# Altium schematic sheet Battery and Charging.SchDoc: Battery and Charging
size 431 x 279 mm; DrawnBy: DD; DocumentNumber: GHL-1-21002; Revision: A; SheetNumber: 3; SheetTotal: 7; ProjectID: 263-03
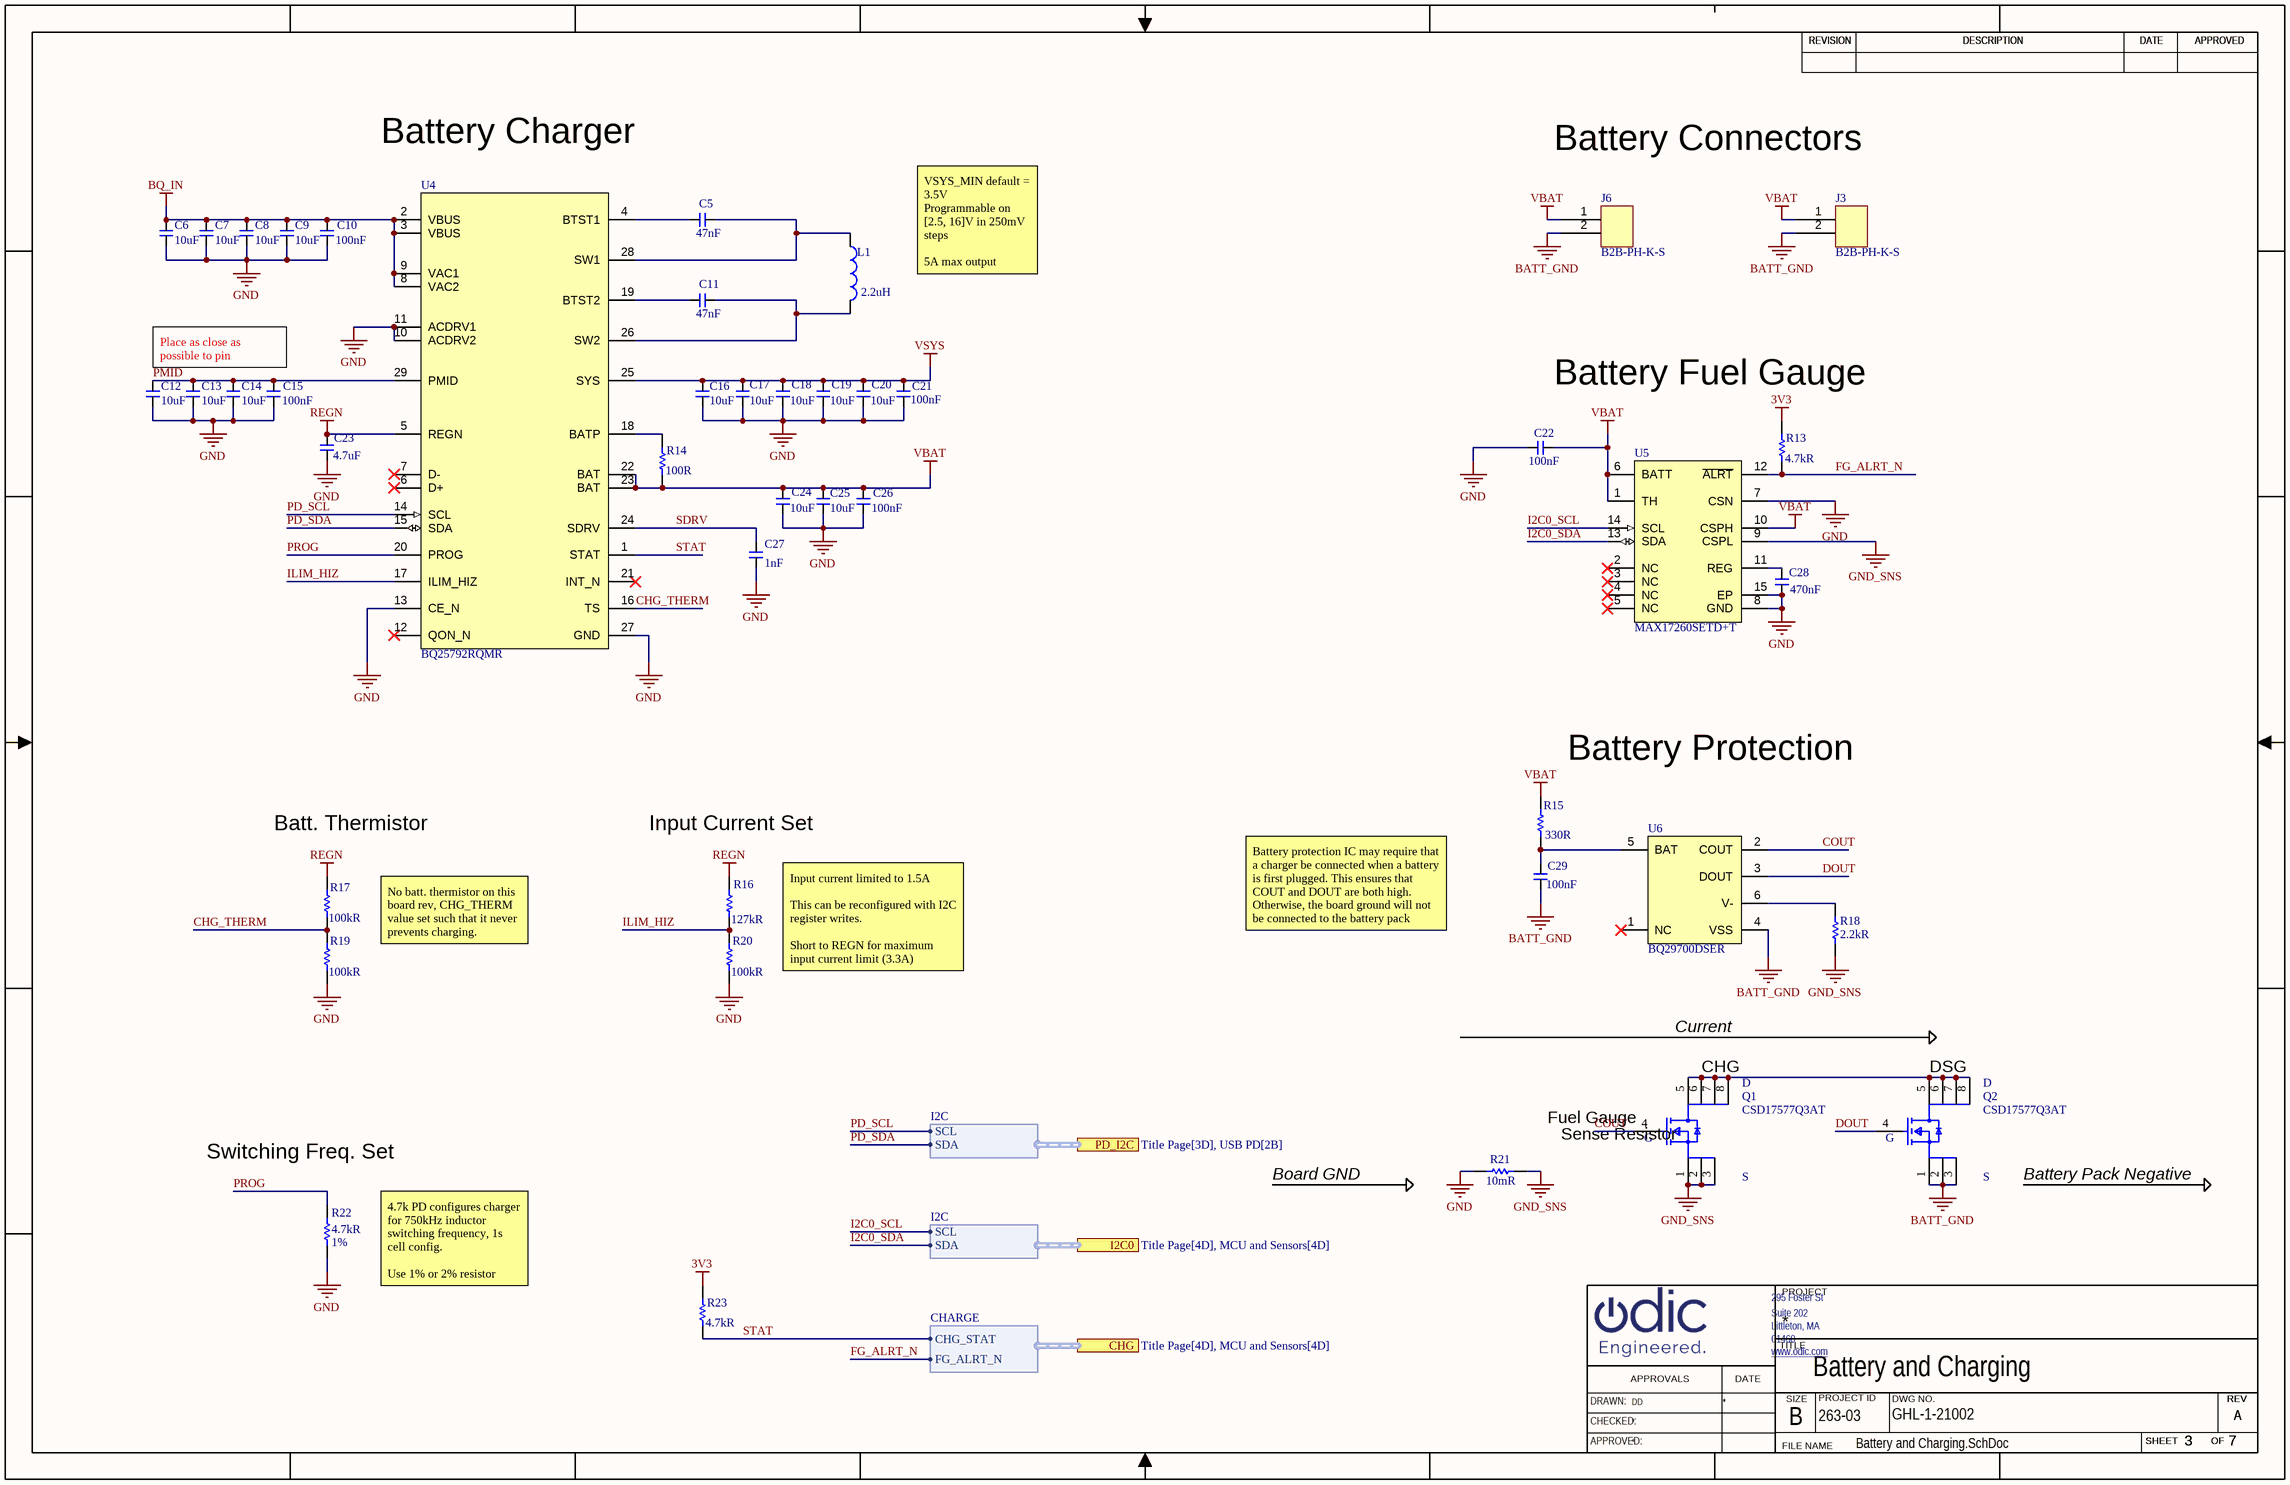
[diagram p0: Battery and Charging.SchDoc]

## Parts
C5  Capacitance: 47nF  [C0402]  (hidden comment: C0402_47n_50V_10pct)
C6  Capacitance: 10uF  [C0603]  (hidden comment: C0603_10u_25V_10pct)
C7  Capacitance: 10uF  [C0603]  (hidden comment: C0603_10u_25V_10pct)
C8  Capacitance: 10uF  [C0603]  (hidden comment: C0603_10u_25V_10pct)
C9  Capacitance: 10uF  [C0603]  (hidden comment: C0603_10u_25V_10pct)
C10  Capacitance: 100nF  [C0402]  (hidden comment: C0402_0u1_25V_10pct)
C11  Capacitance: 47nF  [C0402]  (hidden comment: C0402_47n_50V_10pct)
C12  Capacitance: 10uF  [C0603]  (hidden comment: C0603_10u_25V_10pct)
C13  Capacitance: 10uF  [C0603]  (hidden comment: C0603_10u_25V_10pct)
C14  Capacitance: 10uF  [C0603]  (hidden comment: C0603_10u_25V_10pct)
C15  Capacitance: 100nF  [C0402]  (hidden comment: C0402_0u1_25V_10pct)
C16  Capacitance: 10uF  [C0603]  (hidden comment: C0603_10u_25V_10pct)
C17  Capacitance: 10uF  [C0603]  (hidden comment: C0603_10u_25V_10pct)
C18  Capacitance: 10uF  [C0603]  (hidden comment: C0603_10u_25V_10pct)
C19  Capacitance: 10uF  [C0603]  (hidden comment: C0603_10u_25V_10pct)
C20  Capacitance: 10uF  [C0603]  (hidden comment: C0603_10u_25V_10pct)
C21  Capacitance: 100nF  [C0402]  (hidden comment: C0402_0u1_25V_10pct)
C22  Capacitance: 100nF  [C0402]  (hidden comment: C0402_100n_16V_10pct)
C23  Capacitance: 4.7uF  [C0402]  (hidden comment: C0402_4u7_10V_20pct)
C24  Capacitance: 10uF  [C0603]  (hidden comment: C0603_10u_25V_10pct)
C25  Capacitance: 10uF  [C0603]  (hidden comment: C0603_10u_25V_10pct)
C26  Capacitance: 100nF  [C0402]  (hidden comment: C0402_0u1_25V_10pct)
C27  Capacitance: 1nF  [C0402]  (hidden comment: C0402_1n_50V_10pct)
C28  Capacitance: 470nF  [C0402]  (hidden comment: C0402_470n_6V3_10pct)
C29  Capacitance: 100nF  [C0402]  (hidden comment: C0402_100n_16V_10pct)
J3  B2B-PH-K-S  [JST_B2B-PH-K-S]
J6  B2B-PH-K-S  [JST_B2B-PH-K-S]
L1  value 2.2uH  [ind2_5p4x5p2mm]  (hidden comment: 0530CDMCCDS-2R2MC)
Q1  CSD17577Q3AT  [dfn8_3p1x3p25_p65mm]
Q2  CSD17577Q3AT  [dfn8_3p1x3p25_p65mm]
R13  Resistance: 4.7kR  [R0402]  (hidden comment: R0402_4k7_1pct)
R14  value 100R  [R0402]  (hidden comment: R0402_100R_1pct)
R15  value 330R  [R0402]  (hidden comment: R0402_300R_1pct)
R16  value 127kR  [R0402]  (hidden comment: R0402_127k_1pct)
R17  Resistance: 100kR  [R0402]  (hidden comment: R0402_100k_1pct)
R18  Resistance: 2.2kR  [R0402]  (hidden comment: R0402_2k2_5pct)
R19  Resistance: 100kR  [R0402]  (hidden comment: R0402_100k_1pct)
R20  Resistance: 100kR  [R0402]  (hidden comment: R0402_100k_1pct)
R21  value 10mR  [R0603]  (hidden comment: R0603_0R01_1pct)
R22  Resistance Tolerance: 1%  Resistance: 4.7kR  [R0402]  (hidden comment: R0402_4k7_1pct)
R23  Resistance: 4.7kR  [R0402]  (hidden comment: R0402_4k7_1pct)
U4  BQ25792RQMR  [qfn29_4x4_p4mm-RQM0029A]
U5  MAX17260SETD+T  [dfn14_3x3_p4mm]
U6  BQ29700DSER  [dfn6_1p5x1p5_p5mm]

## Ports
CHG (harness CHARGE, see Title Page[4D], MCU and Sensors[4D]), I2C0 (harness I2C, see Title Page[4D], MCU and Sensors[4D]), PD_I2C (harness I2C, see Title Page[3D], USB PD[2B])

## Harnesses
CHARGE: CHG_STAT, FG_ALRT_N
I2C: SCL, SDA

## Nets
3V3: R13.2 R23.2
BATT_GND: C29.1 J3.2 J6.2 Q2.1(S) Q2.2(S) Q2.3(S) U6.4(VSS)
BQ_IN: C6.2 C7.2 C8.2 C9.2 C10.2 U4.2(VBUS) U4.3(VBUS) U4.8(VAC2) U4.9(VAC1)
GND: C6.1 C7.1 C8.1 C9.1 C10.1 C12.1 C13.1 C14.1 C15.1 C16.1 C17.1 C18.1 C19.1 C20.1 C21.1 C22.2 C23.1 C24.1 C25.1 C26.1 C27.1 C28.1 R19.1 R20.1 R21.1 R22.1 U4.10(ACDRV2) U4.11(ACDRV1) U4.13(CE_N) U4.27(GND) U5.7(CSN) U5.8(GND) U5.15(EP)
GND_SNS: Q1.1(S) Q1.2(S) Q1.3(S) R18.2 R21.2 U5.9(CSPL)
REGN: C23.2 R16.2 R17.2 U4.5(REGN)
VBAT: C22.1 C24.2 C25.2 C26.2 J3.1 J6.1 R14.1 R15.2 U4.22(BAT) U4.23(BAT) U5.1(TH) U5.6(BATT) U5.10(CSPH)
VSYS: C16.2 C17.2 C18.2 C19.2 C20.2 C21.2 U4.25(SYS)
CHG_THERM: R17.1 R19.2 U4.16(TS)
COUT: Q1.4(G) U6.2(COUT)
DOUT: Q2.4(G) U6.3(DOUT)
FG_ALRT_N: R13.1 U5.12(~{ALRT}) ; port CHG.FG_ALRT_N
I2C0_SCL: U5.14(SCL) ; port I2C0.SCL
I2C0_SDA: U5.13(SDA) ; port I2C0.SDA
ILIM_HIZ: R16.1 R20.2 U4.17(ILIM_HIZ)
PD_SCL: U4.14(SCL) ; port PD_I2C.SCL
PD_SDA: U4.15(SDA) ; port PD_I2C.SDA
PMID: C12.2 C13.2 C14.2 C15.2 U4.29(PMID)
PROG: R22.2 U4.20(PROG)
SDRV: C27.2 U4.24(SDRV)
STAT: R23.1 U4.1(STAT) ; port CHG.CHG_STAT
NetC5_1: C5.1 L1.1 U4.28(SW1)
NetC5_2: C5.2 U4.4(BTST1)
NetC11_1: C11.1 L1.2 U4.26(SW2)
NetC11_2: C11.2 U4.19(BTST2)
NetC28_2: C28.2 U5.11(REG)
NetC29_2: C29.2 R15.1 U6.5(BAT)
NetQ1_5: Q1.5(D) Q1.6(D) Q1.7(D) Q1.8(D) Q2.5(D) Q2.6(D) Q2.7(D) Q2.8(D)
NetR14_2: R14.2 U4.18(BATP)
NetR18_1: R18.1 U6.6(V-)

Not connected (* = marked no-connect by the designer): U4 6(D+)* 7(D-)* 12(QON_N)* 21(INT_N)*; U5 2(NC)* 3(NC)* 4(NC)* 5(NC)*; U6 1(NC)*

## Notes on the sheet
- Battery Charger
- Battery Connectors
- VSYS_MIN default = 3.5V
  Programmable on [2.5, 16]V in 250mV steps
  5A max output
- Place as close as possible to pin
- Battery Fuel Gauge
- (near R15) Battery Protection
- Batt. Thermistor
- Input Current Set
- No batt. thermistor on this board rev, CHG_THERM value set such that it never prevents charging.
- Input current limited to 1.5A
  This can be reconfigured with I2C register writes.
  Short to REGN for maximum input current limit (3.3A)
- Battery protection IC may require that a charger be connected when a battery is first plugged. This ensures that COUT and DOUT are both high. Otherwise, the board ground will not be connected to the battery pack negative
- Current
- (near Q1) CHG
- (near Q2) DSG
- Switching Freq. Set
- (near R21) Fuel Gauge
- (near R21) Sense Resistor
- Board GND
- Battery Pack Negative
- 4.7k PD configures charger for 750kHz inductor switching frequency, 1s cell config.
  Use 1% or 2% resistor
- REVISION
- DESCRIPTION
- DATE
- APPROVED
- 295 Foster St
- PROJECT
- www.odic.com <http://www.odic.com>
- Littleton, MA
- 01460
- Suite 202
- TITLE
- DRAWN:
- CHECKED:
- APPROVALS
- SIZE
- B
- PROJECT ID
- DWG NO.
- SHEET
- OF
- REV
- APPROVED:
- FILE NAME

## Library data of the parts
C5 C11 = CMP-00644-3: CGA2B3X7R1H473K050BB; Voltage Rating (DC): 50V; Tolerance: 10%; Dielectric: X7R; Install: POP; Weight: 2.3E-05oz; Case Code (Metric): 1005; Min Operating Temperature: -55°C; Width: 0.02inch; RoHS Compliant: Yes; Thickness: 0.022inch; Ratings: AEC-Q200; Case/Package: 0402; Reach SVHC Compliant: No; Lead Free: Lead Free; Construction: Flat; Mount: Surface Mount; Depth: 0.5mm; Max Operating Temperature: 125°C; Voltage Rating: 50V; Packaging: Tape and Reel; Package Quantity: 1; Series: CGA; Termination: SMD/SMT; Height: 0.5mm; Length: 1mm; Case Code (Imperial): 0402
C6-C9 C12-C14 C16-C20 C24 C25 = CMP-00643-2: GRM188R61E106KA73J; Tolerance: 10%; Voltage Rating: 25V; Install: POP; Case/Package: 0603; RoHS Compliant: Yes; Mount: Surface Mount; Max Operating Temperature: 85°C; Min Operating Temperature: -55°C; Series: GRM
C10 C15 C21 C26 = CMP-00369-1: Cap Ceramic 0.1uF 25V X5R 10% Pad SMD 0402 Multi Layer Ceramic Capacitor (MLCC); Install: POP; Packaging: Tape and Reel; Construction: Flat; Max Operating Temperature: 85°C; Case Code (Metric): 1005; Voltage Rating (DC): 25V; Min Operating Temperature: -55°C; Height: 0.5mm; Series: CL; Case/Package: 0402; Voltage: 25V; Package Quantity: 1; Radiation Hardening: No; Depth: 0.5mm; Thickness: 0.022inch; Lead Free: Lead Free; Tolerance: 10%; Length: 1mm; Mount: Surface Mount; Width: 0.02inch; Dielectric: X5R; RoHS Compliant: Yes; Voltage Rating: 25V; Case Code (Imperial): 0402
C22 C29 = CMP-00301-3: 0.1 µF ±10% 16V Ceramic Capacitor X7R 0402 (1005 Metric); Install: POP; Voltage: 16V; Voltage Rating (DC): 16V; Case/Package: 0402; RoHS Compliant: Yes; Dielectric Material: Ceramic; Package Quantity: 1; Dielectric: X7R; Termination: SMD/SMT; Depth: 0.5mm; Radiation Hardening: No; Construction: Flat; Tolerance: 10%; Case Code (Imperial): 0402; Voltage Rating: 16V; Max Operating Temperature: 125°C; Length: 1mm; Lead Free: Lead Free; REACH SVHC: No SVHC; Packaging: Tape and Reel; Mount: Surface Mount,PCB; Series: -; Case Code (Metric): 1005; Min Operating Temperature: -55°C; Width: 0.02inch; Thickness: 0.022inch; Height: 0.56mm; Contact Plating: Tin,Matte
C23 = CMP-00316-1: Cap Ceramic 4.7uF 10V X5R 20% SMD 0402 85°C Paper T/R; Install: POP; Width: 0.02inch; Package Quantity: 10000; Min Operating Temperature: -55°C; Mount: Surface Mount; Case Code (Imperial): 0402; Case/Package: 0402; Series: CL; Packaging: Cut Tape; Length: 0.039inch; Dielectric: X5R; Voltage Rating: 10V; Thickness: 0.022inch; Tolerance: 20%; Max Operating Temperature: 85°C; RoHS Compliant: Yes; Case Code (Metric): 1005; Lead Free: Lead Free
C27 = CMP-00366-1: 0402 1 nF 50V ±10 % Tolerance X7R Surface Mount Multilayer Ceramic Capacitor; Dissipation Factor: 2.5%; Install: POP; Tolerance: 10%; Insulation Resistance: 100GR; RoHS Compliant: Yes; Termination: SMD/SMT; Radiation Hardening: No; Length: 1mm; Contact Plating: Tin,Matte; Voltage Rating (DC): 50V; Thickness: 0.022inch; Case/Package: 0402; Height: 0.56mm; Mount: Surface Mount; Series: -; Construction: Flat; Lead Free: Lead Free; Case Code (Metric): 1005; Reach SVHC Compliant: Yes; Max Operating Temperature: 125°C; Width: 0.02inch; Depth: 0.5mm; Packaging: Tape and Reel; Number of Pins: 2; Voltage: 50V; Package Quantity: 1; Min Operating Temperature: -55°C; Dielectric: X7R; Voltage Rating: 50V; Case Code (Imperial): 0402
C28 = CMP-00343-1: Ceramic capacitor SMD-0402 470nF /6, 3V X5R# K +-10%, Samsung, RoHS; Dielectric: X5R; Voltage Rating: 6.3V; Install: POP; Tolerance: 10%; Height: 0.5mm; Case/Package: 0402; Contact Plating: Tin; Series: CL; Voltage Rating (DC): 6.3V; Lead Free: Lead Free; Mount: Surface Mount; Width: 0.02inch; Length: 1mm; Voltage: 6.3V; Thickness: 0.022inch; Package Quantity: 1; Case Code (Metric): 1005; Packaging: Tape and Reel; Radiation Hardening: No; Min Operating Temperature: -55°C; Depth: 0.5mm; Case Code (Imperial): 0402; RoHS Compliant: Yes; Construction: Flat; Max Operating Temperature: 85°C
J3 J6 = CMP-00685-3: Connector Header, PH Series, 2 Position, 2.00mm, Through Hole, Press-Fit, Solder, Natural; Working Voltage: 100V; Current Rating: 2A; Contact Resistance: 20mR; Mated Stacking Heights: 8mm; Contact Post Length: 0.134inch; Insulation Resistance: 1MR; Gender: Male; Number of Contacts: 2; Pitch: 2mm; Series: PH; Insulation Height: 0.236inch; Contact Plating: Tin,Copper; Contact Mating Length: 0.13inch; Depth: 4.5mm; Contact Finish - Mating: TIN; Max Voltage Rating (DC): 100V; Lead Free: Lead Free; Max Current Rating: 2A; Flammability Rating: UL94 V-0; Contact Material: Brass; Housing Color: White; Mounting Technology: Through Hole; Max Voltage Rating (AC): 100V; Number of Rows: 1; Contact Shape: Square; Voltage Rating: 100V; Length: 5.9mm; Housing Material: Polyamide; Pins: 2; Termination: Press-Fit; Height: 9.4mm; Lead Pitch: 2mm; Connector Type: Header; Width: 4.5mm; Orientation: Straight; Fastening Type: Detent; Min Operating Temperature: -25°C; Insulation Material: Nylon; Max Operating Temperature: 85°C; Color: Natural; Reach SVHC Compliant: Yes; Number of Poles: 2; Packaging: Bulk; Contact Type: Male Pin; Number of Positions: 2; Insulation Color: Natural; Voltage Rating (AC): 100V
L1 = CMP-00675-2: FIXED IND 2.2UH 5.8A 29 MOHM; Shielding: Shielded; Install: POP; Saturation Current: 9A; Tolerance: 20%; Core Material: Metal; DC Resistance (DCR): 29mR; Test Frequency: 100kHz; Length: 0.205inch; RoHS Compliant: Yes; Min Operating Temperature: -55°C; Case/Package: Nonstandard; Packaging: Tape and Reel; Series: 0530CDMC/DS; Max Operating Temperature: 125°C; Current Rating: 5.8A; Width: 0.205inch; Height - Seated (Max): 0.118inch; Mounting Technology: Surface Mount
Q1 Q2 = CMP-00688-3: 30-V, N channel NexFET™ power MOSFET, single SON 3 mm x 3 mm, 6.4 mOhm 8-VSONP -55 to 150; Drain to Source Resistance: 5.3mR; Power Dissipation: 2.8W; Threshold Voltage: 1.4V; Drain to Source Breakdown Voltage: 30V; Max Power Dissipation: 53W; Turn-Off Delay Time: 20ns; Number of Channels: 1; Gate to Source Voltage (Vgs): 20V; Rds On Max: 4.8mR; Fall Time: 4ns; Input Capacitance: 2.31nF; Polarity: N-CHANNEL; Continuous Drain Current (ID): 19A; Rise Time: 31ns; Install: POP; Case/Package: VSON; Pins: 8; Max Operating Temperature: 150°C; Series: NexFET™; Lead Free: Lead Free; Min Operating Temperature: -55°C; Element Configuration: Single; Reach SVHC Compliant: No; RoHS Compliant: Yes; Packaging: Tape and Reel; Number of Elements: 1; Mounting Technology: Surface Mount; Turn-On Delay Time: 4ns; Contact Plating: Tin; Drain to Source Voltage (Vdss): 30V; Package Quantity: 250
R13 R22 R23 = CMP-00336-2: RES 4.7K OHM 1% 1/16W 0402; Install: POP; Temperature Coefficient: 100ppm/°C; Voltage Rating: 50V; Max Power Dissipation: 63mW; Power Rating: 62.5mW; Features: Moisture Resistant; Length: 1mm; REACH SVHC: No SVHC; RoHS Compliant: Yes; Military Standard: Not; Size Code: 0402; Series: RC; Width: 0.5mm; Lead Free: Lead Free; Max Operating Temperature: 155°C; Height: 0.32mm; Voltage Rating (DC): 50V; Construction: Rectangular; Packaging: Tape and Reel; Tolerance: 1%; Case Code (Metric): 1005; Case Code (Imperial): 0402; Number of Pins: 2; Resistor Type: Thick Film; Number of Terminations: 2; Termination: SMD/SMT; Min Operating Temperature: -55°C; Case/Package: 0402; Height - Seated (Max): 0.016inch; Depth: 0.5mm
  R13 R23: Resistance Tolerance: 1%
R14 = CMP-009-00016-1: Res General Purpose Thick Film 0402 100 Ohm 1% 1/16W ±200ppm/°C Molded SMD Paper T/R; Voltage Rating (DC): 50V; Power Rating: 62.5mW; Install: POP; Max Power Dissipation: 63mW; Temperature Coefficient: 100ppm/°C; Reach SVHC Compliant: No; Construction: Rectangular; Case/Package: 0402; Military Standard: Not; Lead Free: Lead Free; Number of Terminations: 2; Case Code (Metric): 1005; Pins: 2; Width: 0.5mm; Features: Moisture Resistant; Tolerance: 1%; Packaging: Tape and Reel; Depth: 0.5mm; Technology: THICK FILM; Series: RC; Min Operating Temperature: -55°C; Height: 0.32mm; RoHS Compliant: Yes; Max Operating Temperature: 155°C; Voltage Rating: 50V; Case Code (Imperial): 0402; Resistance Tolerance: 1%; Termination: SMD/SMT; Resistor Type: Thick Film; Length: 1mm
R15 = CMP-00687-2: SMD Chip Resistor, 330 Ohm, ± 1%, 63 mW, 0402 [1005 Metric], Thick Film, General Purpose; Temperature Coefficient: 100ppm/°C; Voltage Rating: 50V; Max Power Dissipation: 63mW; Power Rating: 62.5mW; Install: POP; Resistance Tolerance: 1%; Packaging: Tape and Reel; Technology: THICK FILM; RoHS Compliant: Yes; Construction: Rectangular; Military Standard: Not; Min Operating Temperature: -55°C; Case Code (Imperial): 0402; Height: 0.016inch; Series: RC; Package Quantity: 1; Depth: 0.5mm; Resistor Type: Thick Film; Reach SVHC Compliant: No; Case/Package: 0402; Tolerance: 1%; Termination: SMD/SMT; Length: 0.039inch; Max Operating Temperature: 155°C; Features: Moisture Resistant; Lead Free: Lead Free; Case Code (Metric): 1005; Number of Terminations: 2; Width: 0.02inch
R16 = CMP-00681-2: SMD Chip Resistor, 127 kOhm, ± 1%, 63 mW, 0402 [1005 Metric], Thick Film, General Purpose; Power Rating: 62.5mW; Voltage Rating: 50V; Max Power Dissipation: 63mW; Temperature Coefficient: 100ppm/°C; Install: POP; Min Operating Temperature: -55°C; Tolerance: 1%; Number of Terminations: 2; Contact Plating: Tin,Matte; Length: 0.039inch; RoHS Compliant: Yes; Height: 0.016inch; Voltage Rating (DC): 50V; Series: RC; Termination: SMD/SMT; Features: Moisture Resistant; Max Operating Temperature: 155°C; Lead Free: Lead Free; Case/Package: 0402; Package Quantity: 1; Case Code (Metric): 1005; Packaging: Tape and Reel; Case Code (Imperial): 0402; Width: 0.02inch
R17 R19 R20 = CMP-00351-1: Res General Purpose Thick Film 0402 100K Ohm 1% 1/16W ±100ppm/°C Molded SMD Paper T/R; Working Voltage: 50V; Install: POP; Power Rating: 63mW; Series: RC; Military Standard: Not; Case Code (Metric): 1005; Features: Moisture Resistant; Termination: SMD/SMT; Number of Terminations: 2; Temperature Coefficient: 100ppm/°C; Height: 0.016inch; Tolerance: 1%; Case/Package: 0402; Depth: 0.5mm; RoHS Compliant: Yes; Resistance Tolerance: 1%; Lead Free: Lead Free; Max Operating Temperature: 155°C; Min Operating Temperature: -55°C; Width: 0.02inch; Packaging: Tape and Reel; Technology: THICK FILM; Case Code (Imperial): 0402; Package Quantity: 1; REACH SVHC: No SVHC; Resistor Type: Thick Film; Max Power Dissipation: 63mW; Voltage Rating: 50V; Length: 0.039inch; Construction: Rectangular
R18 = CMP-00405-3: Res Thick Film 0402 2.2K Ohm 5% 1/10W +/-200ppm/ßC Molded SMD Punched Carrier T/R; Power Rating: 100mW; Voltage Rating (DC): 50V; Temperature Coefficient: 200ppm/°C; Install: POP; Weight: 2.8E-05oz; Height: 0.35mm; Min Operating Temperature: -55°C; Package Quantity: 10000; Size Code: 0402; Packaging: Tape and Reel; Military Standard: Not; Mount: Surface Mount; Max Power Dissipation: 100mW; Tolerance: 5%; Voltage Rating: 50V; RoHS Compliant: Yes; Resistance Tolerance: 5%; Resistor Type: Thick Film; Series: ERJ; Termination: SMD/SMT; Case/Package: 0402; Ratings: AEC-Q200; Case Code (Imperial): 0402; Max Operating Temperature: 155°C; Length: 1mm; Lead Free: Lead Free; Technology: THICK FILM; Features: Automotive AEC-Q200; Number of Terminations: 2; Reach SVHC Compliant: Yes; Radiation Hardening: No; Case Code (Metric): 1005; Width: 0.5mm; Depth: 0.5mm; Contact Plating: Tin; Construction: Rectangular
R21 = CMP-00815-1: SMD Chip Resistor, 10 Milliohm, ± 1%, 250 mW, 0603 [1608 Metric], Thick Film, High Power; Temperature Coefficient: 300ppm/°C; Install: POP; Max Power Dissipation: 250mW; Tolerance: 1%; Max Operating Temperature: 125°C; Case/Package: 0603; Case Code (Imperial): 0603; Packaging: Tape and Reel; Length: 0.063inch; Ratings: AEC-Q200; Package Quantity: 5000; Case Code (Metric): 1608; Lead Free: Lead Free; Width: 0.031inch; Features: Automotive AEC-Q200; RoHS Compliant: Yes; Min Operating Temperature: -55°C; Height: 0.026inch; Series: ERJ; Number of Terminations: 2
U4 = CMP-058-000000-7: I2C Controlled, 1-4 Cell, 5-A Buck-Boost Battery Charger with Dual-Input; Mfr_Name: Texas Instruments; Install: POP; TYPE: TYPE; Source: PQ25792RQMR.SchLib; Design Item ID: BQ25792RQMR; RefDes: RefDes; RoHS Compliant: Yes
U5 = CMP-00648-4: Battery Management 5.1 A 1-Cell Fuel Gauge with ModelGauge m5 EZ and Optional H; Install: POP; RoHS Compliant: Yes
U6 = CMP-00679-4: Li-Ion/Li Polymer Advanced Single-Cell Battery Protector IC Family 6-WSON -40 to 85; Operating Supply Voltage: 8V; Fault Protection: Over Current,Short Circuit,Over/Under Voltage; Number of Cells: 1; Install: POP; Packaging: Tape and Reel; Max Operating Temperature: 85°C; Lead Free: Lead Free; Contact Plating: Gold; Mounting Technology: Surface Mount; Series: -; Package Quantity: 3000; Pins: 6; Min Operating Temperature: -40°C; RoHS Compliant: Yes; Weight: 0.000342oz; Case/Package: WFDFN